# Altium project Wien.PrjPcb
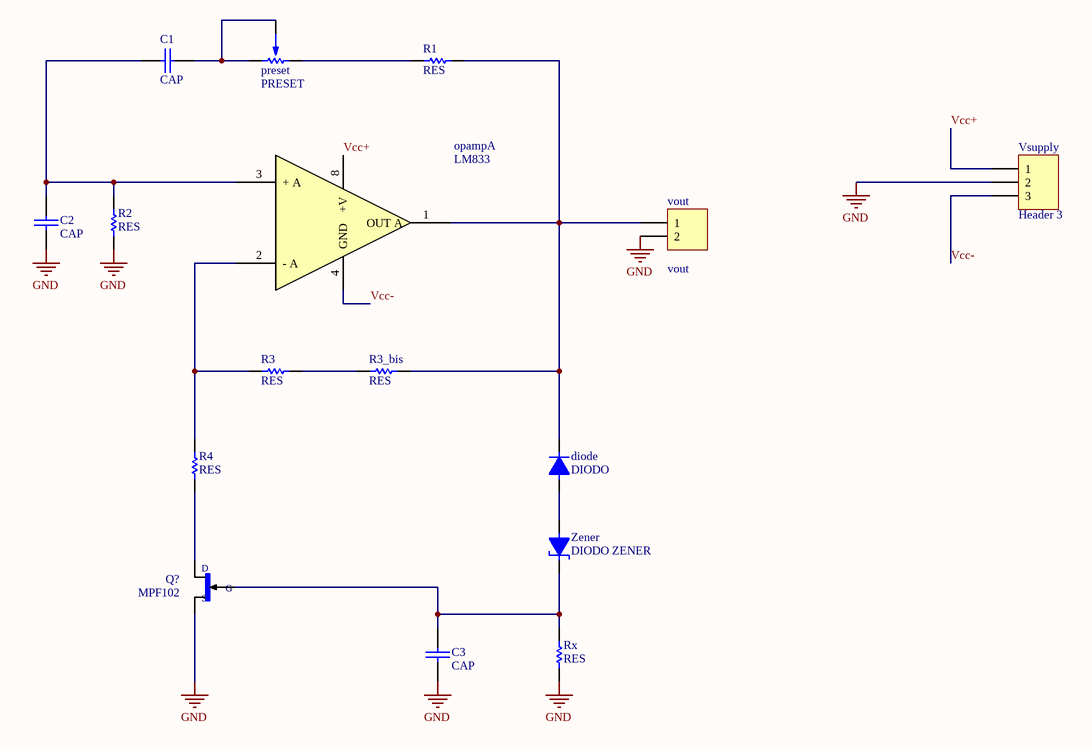
[diagram p0: Wien_Schematic.SchDoc]
2 sheets, 16 parts. Net scope: global (net labels, ports and power ports of the same name join across sheets).
Board files: Wien_PCB.PcbDoc, smd.PcbDoc
Sheets:
  Wien_Schematic.SchDoc
  wien_smd_schem.SchDoc

## Sheet Wien_Schematic.SchDoc
size A4

### Parts
C1  CAP  [CAP200]
C2  CAP  [CAP200]
C3  CAP  [CAP200]
diode  DIODO  [DO41]
opamp  LM833  [DIP8]  (part A of 2)
preset  PRESET  [PRESET V]
Q?  MPF102  [TO92F]
R1  RES  [RES400]
R2  RES  [RES400]
R3  RES  [RES400]
R3_bis  RES  [RES400]
R4  RES  [RES400]
Rx  RES  [RES400]
vout  vout  [HDR1X2]
Vsupply  Header 3  [HDR1X3]
Zener  DIODO ZENER  [DO41]

### Nets
GND: C2.2 C3.2 Q?.2(S) R2.1 Rx.1 vout.2 Vsupply.2
Vcc+: opamp.8(+V) Vsupply.1
Vcc-: opamp.4(GND) Vsupply.3
NetC1_1: C1.1 C2.1 opamp.3(+_A) R2.2
NetC1_2: C1.2 preset.1 preset.2
NetC3_1: C3.1 Q?.3(G) Rx.2 Zener.2
Netdiode_1: diode.1 Zener.1
Netdiode_2: diode.2 opamp.1(OUT_A) R1.2 R3_bis.2 vout.1
Netopamp_2: opamp.2(-_A) R3.1 R4.2
Netpreset_3: preset.3 R1.1
NetQ?_1: Q?.1(D) R4.1
NetR3_2: R3.2 R3_bis.1

### Library data of the parts
opamp = LM833: Dual Audio Operational Amplifier
Q? = MPF102: MF: Freescale Semiconductor; MP: MPF102; Package: None; Availability: Unavailable; Price: None; SnapEDA_Link: https://www.snapeda.com/parts/MPF102/Freescale%20Semiconductor/view-part/?ref=snap; Value: *
vout = Header 2: Header, 2-Pin; LatestRevisionDate: 17-Jul-2002; LatestRevisionNote: Re-released for DXP Platform.; Publisher: Altium Limited
Vsupply = Header 3: Header, 3-Pin; LatestRevisionDate: 17-Jul-2002; LatestRevisionNote: Re-released for DXP Platform.; Publisher: Altium Limited

## Sheet wien_smd_schem.SchDoc
size A4